# EAGLE design p2d-001 (EAGLE 9.6.2)
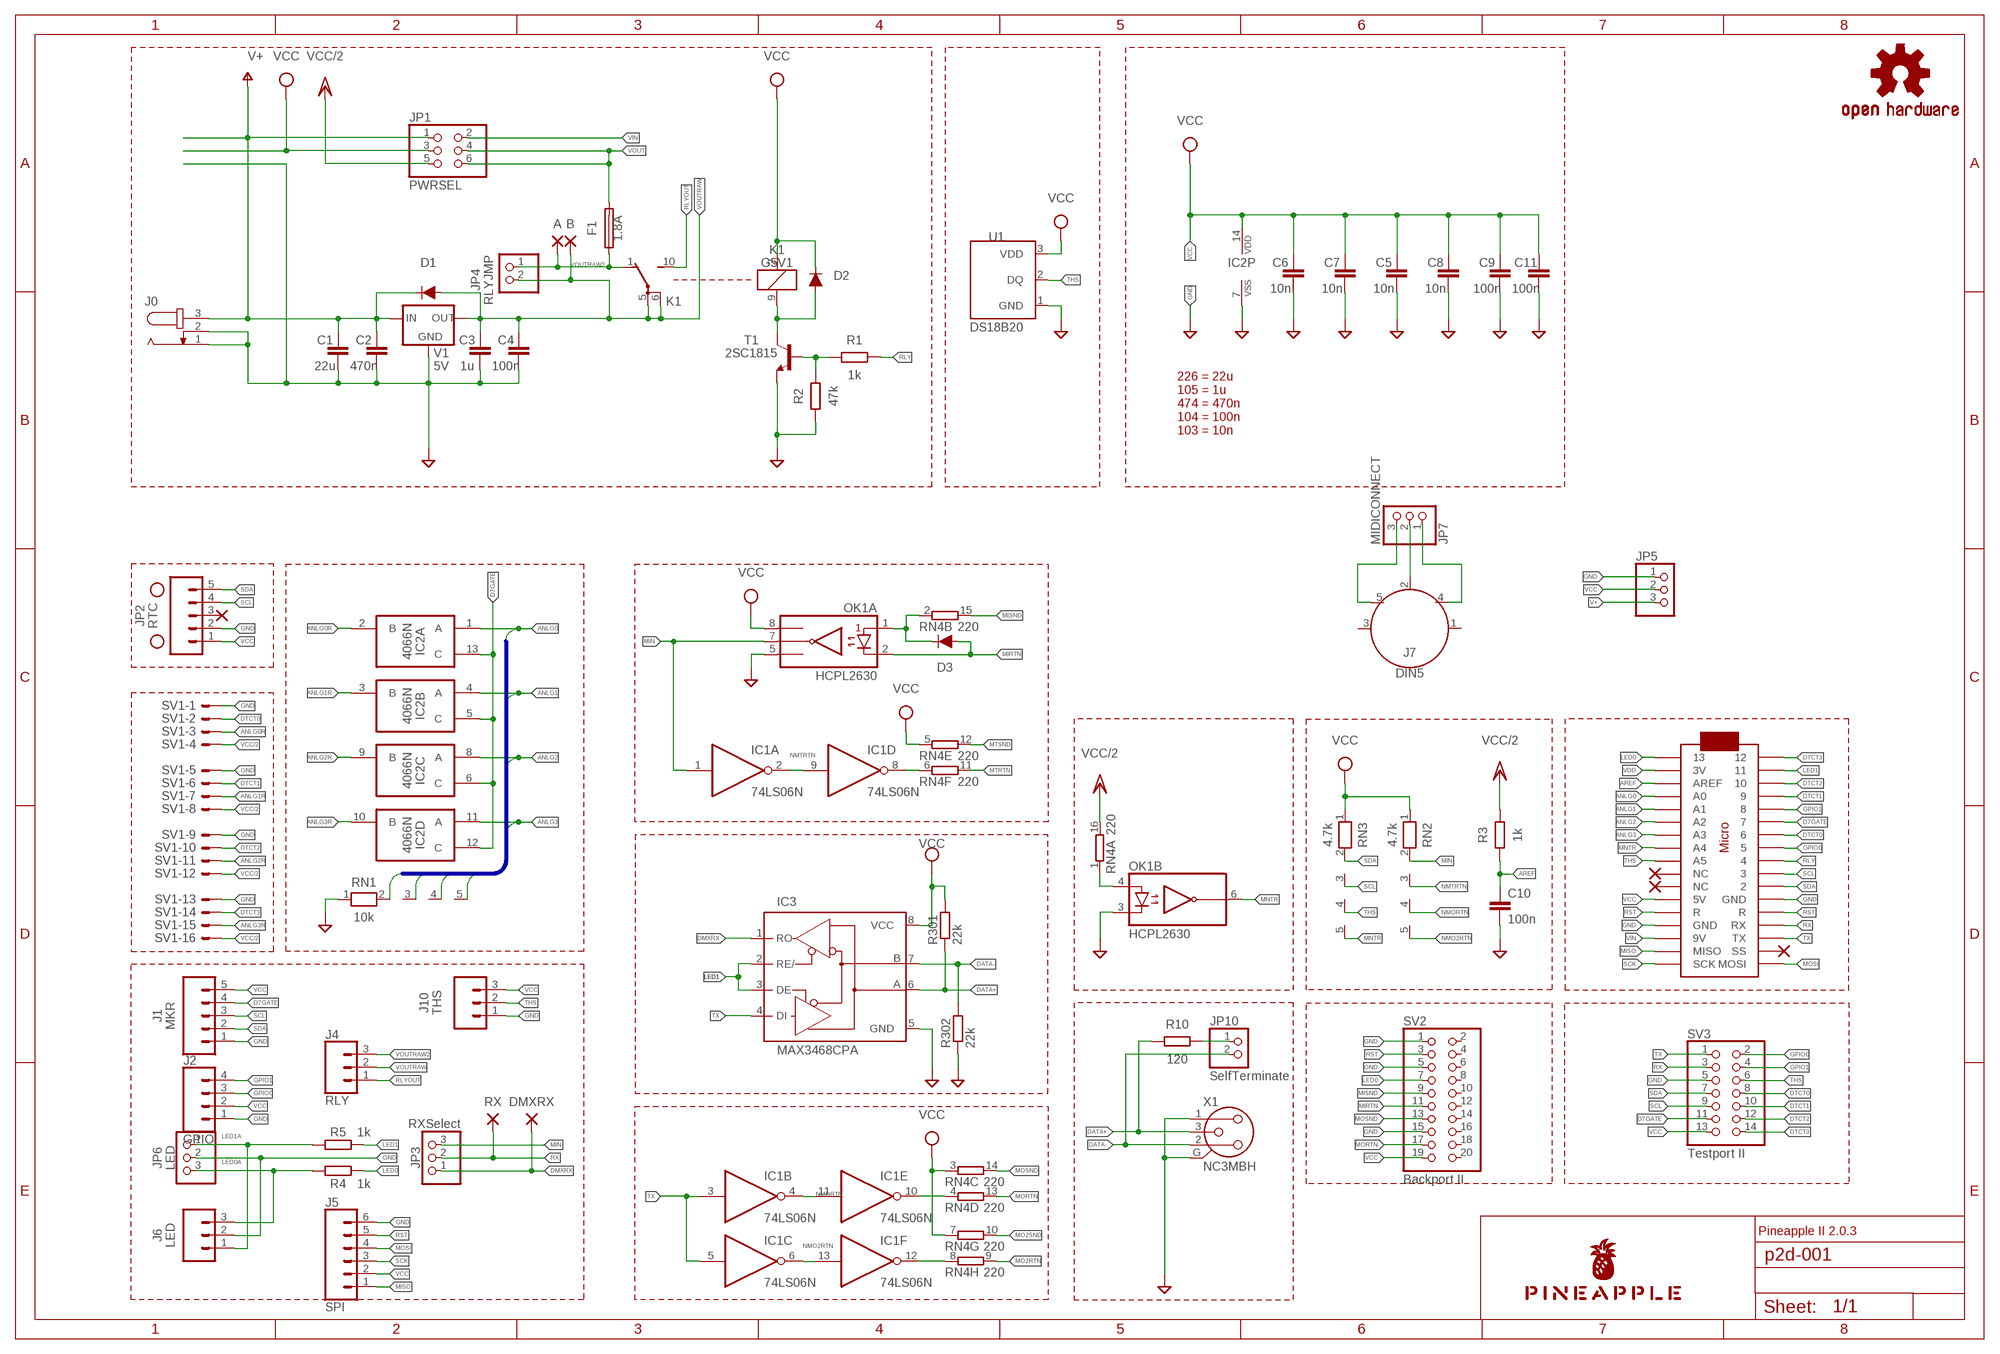
[diagram p0: schematic, sheet 1]

## Parts
A  SMD2  [SMD1,27-2,54]
B  SMD2  [SMD1,27-2,54]
C1  22u  C-EU025-050X050  [C025-050X050]
C2  470n  C-EU050-024X044  [C050-024X044]
C3  1u  C-EU050-024X044  [C050-024X044]
C4  100n  C-EU025-024X044  [C025-024X044]
C5  10n  C-EU025-024X044  [C025-024X044]
C6  10n  C-EU025-024X044  [C025-024X044]
C7  10n  C-EU025-024X044  [C025-024X044]
C8  10n  C-EU025-024X044  [C025-024X044]
C9  100n  C-EU025-024X044  [C025-024X044]
C10  100n  C-EU025-024X044  [C025-024X044]
C11  100n  C-EU025-024X044  [C025-024X044]
D1  DIODE-1N4148  [DIODE-1N4148]
D2  DIODE-1N4148  [DIODE-1N4148]
D3  DIODE-1N4148  [DIODE-1N4148]
DMXRX  SMD2  [SMD1,27-2,54]
F1  1.8A  TE5  [TE5]
H1  STAND-OFF  [STAND-OFF]
H2  STAND-OFF  [STAND-OFF]
IC1  74LS06N  [DIL14]
IC2  4066N  [DIL14]
IC3  MAX3468CPA  [DIL08]
J0  JACK-PLUG0  [SPC4077]
J1  MKR  CONN_05JST  [JST-5-PTH]
J2  GPIO  CONN_04JST-PTH  [JST-4-PTH]
J4  RLY  CONN_03JST-PTH-NS  [JST-3-PTH-NS]
J5  SPI  CONN_061.27MM  [1X06_1.27MM]
J6  LED  CONN_03JST-PTH-VERT  [JST-3-PTH-VERT]
J7  DIN5  [DIN5-RA-PTH]
J10  THS  CONN_03JST-PTH  [JST-3-PTH]
JP1  PWRSEL  PINHD-2X3  [2X03]
JP2  RTC  CONN_05  [1X05]
JP3  RXSelect  PINHD-1X3  [1X03]
JP4  RLYJMP  PINHD-1X2  [1X02]
JP5  PINHD-1X3  [1X03]
JP6  LED  PINHD-1X3  [1X03]
JP7  MIDICONNECT  PINHD-1X3  [1X03]
JP10  SelfTerminate  PINHD-1X2  [1X02]
K1  G5V1  [G5V1]
LOGO1  OSHW-LOGOS-COPPER  [OSHW-LOGO-S_COPPER]
MC1  ARDUINOMICRO  [ARDUINOMICRO]
OK1  HCPL2630  [DIL08]
R1  1k  R-EU_0204/5  [0204/5]
R2  47k  R-EU_0204/5  [0204/5]
R3  1k  R-EU_0204/5  [0204/5]
R4  1k  R-EU_0204/5  [0204/5]
R5  1k  R-EU_0204/5  [0204/5]
R10  120  R-EU_0204/5  [0204/5]
R301  22k  R-EU_M2012  [M2012]
R302  22k  R-EU_M2012  [M2012]
RN1  10k  RN04  [RN-5]
RN2  4.7k  RN04  [RN-5]
RN3  4.7k  RN04  [RN-5]
RN4  220  8R-N  [DIL16]
RX  SMD2  [SMD1,27-2,54]
SV1  ML16LE  [ML16L]
SV2  Backport II  PINHD-2X10  [2X10]
SV3  Testport II  PINHD-2X7  [2X07]
T1  2SC1815  [TO92-ECB]
U1  DS18B20  [TO-92-AMMO]
U$1  PINEAPPLE450_SILK  [PINEAPPLE450_SILK]
V1  5V  78XXL  [78XXL]
X1  NC3MBH  [NC3MBH]

## Nets
ANLG0 [analog]: IC2.1(A:A) MC1.P$31(A0) RN1.2
ANLG0R [analog]: IC2.2(A:B) SV1.3
ANLG1 [analog]: IC2.4(B:A) MC1.P$30(A1) RN1.3
ANLG1R [analog]: IC2.3(B:B) SV1.7
ANLG2 [analog]: IC2.8(C:A) MC1.P$29(A2) RN1.4
ANLG2R [analog]: IC2.9(C:B) SV1.11
ANLG3 [analog]: IC2.11(D:A) MC1.P$28(A3) RN1.5
ANLG3R [analog]: IC2.10(D:B) SV1.15
AREF: C10.1 MC1.P$32(AREF) R3.1
D7GATE: IC2.5(B:C) IC2.6(C:C) IC2.12(D:C) IC2.13(A:C) J1.4 MC1.P$6 SV3.11
DATA+: IC3.6(A) R10.1 R301.1 X1.3
DATA+R: JP10.1 R10.2
DATA-: IC3.7(B) JP10.2 R302.2 X1.2
DIN2: J7.2 JP7.2
DIN4: J7.4 JP7.1
DIN5: J7.5 JP7.3
DMXRX: DMXRX.1(P) IC3.1(RO) JP3.1
DTCT0: MC1.P$7 SV1.2 SV3.8
DTCT1: MC1.P$4 SV1.6 SV3.10
DTCT2: MC1.P$3 SV1.10 SV3.12
DTCT3: MC1.P$1 SV1.14 SV3.14
GND [gnd]: C1.2 C2.2 C3.2 C4.2 C5.2 C6.2 C7.2 C8.2 C9.2 C10.2 C11.2 IC2.7(P:VSS) IC3.5(GND) J0.1 J0.2 J1.1 J2.1 J5.6 J6.2 J10.1 JP2.2 JP5.1 JP6.2 MC1.P$12(GND) MC1.P$21(GND) OK1.3(B:C2) OK1.5(A:GND) R2.1 R302.1 RN1.1 SV1.1 SV1.5 SV1.9 SV1.13 SV2.1 SV2.5 SV2.15 SV3.5 T1.E U1.1(GND) V1.GND X1.1 X1.G
GPIO0: J2.3 MC1.P$8 SV3.2
GPIO1: J2.4 MC1.P$5 SV3.4
LED0: MC1.P$34 R4.2 SV2.7
LED0A: J6.3 JP6.3 R4.1
LED1: IC3.2(RE/) IC3.3(DE) MC1.P$2 R5.2
LED1A: J6.1 JP6.1 R5.1
MIN: IC1.1(A:I) JP3.3 OK1.7(A:VO1) RN2.2
MIRTN [gnd]: D3.A OK1.2(A:C1) SV2.11
MISND: RN4.15 SV2.9
MISNDA [gnd]: D3.C OK1.1(A:A1) RN4.2
MISO: J5.1 MC1.P$19(MISO)
MNTR: MC1.P$27(A4) OK1.6(B:VO2) RN3.5
MNTRA: OK1.4(B:A2) RN4.1
MO2RTN: RN4.9
MO2RTNR: IC1.12(F:O) RN4.8
MO2SND: RN4.10
MORTN: RN4.13 SV2.17
MORTNR: IC1.10(E:O) RN4.4
MOSI: J5.4 MC1.P$17(MOSI)
MOSND: RN4.14 SV2.13
MTRTN: RN4.11
MTRTNR: IC1.8(D:O) RN4.6
MTSND: RN4.12
NMO2RTN: IC1.6(C:O) IC1.13(F:I) RN2.5
NMORTN: IC1.4(B:O) IC1.11(E:I) RN2.4
NMTRTN: IC1.2(A:O) IC1.9(D:I) RN2.3
RLY: MC1.P$9 R1.2
RLYDRV: R1.1 R2.2 T1.B
RLYOUT: J4.1 K1.10(2:S)
RLYSNK: D2.A K1.9 T1.C
RST: J5.5 MC1.P$13(R) MC1.P$22(R) SV2.3
RX: JP3.2 MC1.P$14(RX) RX.1(P) SV3.3
SCK: J5.3 MC1.P$18(SCK)
SCL: J1.3 JP2.4 MC1.P$10 RN3.3 SV3.9
SDA: J1.2 JP2.5 MC1.P$11 RN3.2 SV3.7
THS: J10.2 MC1.P$26(A5) RN3.4 SV3.6 U1.2(DQ)
TX: IC1.3(B:I) IC1.5(C:I) IC3.4(DI) MC1.P$15(TX) SV3.1
V+ [superpower]: C1.1 C2.1 D1.C J0.3 JP1.1 JP5.3 V1.IN
VCC [power]: C5.1 C6.1 C7.1 C8.1 C9.1 C11.1 D2.C IC2.14(P:VDD) IC3.8(VCC) J1.5 J2.2 J5.2 J10.3 JP1.3 JP2.1 JP5.2 K1.2 MC1.P$23(5V) OK1.8(A:VCC) R301.2 RN2.1 RN3.1 RN4.3 RN4.5 RN4.7 SV2.19 SV3.13 U1.3(VDD)
VCC/2 [superpower]: JP1.5 R3.2 RN4.16 SV1.4 SV1.8 SV1.12 SV1.16
VDD [power]: MC1.P$33(3V)
VIN [superpower]: JP1.2 MC1.P$20(9V)
VOUT [superpower]: F1.2 JP1.4 JP1.6
VOUTRAW [superpower]: B.1(P) C3.1 C4.1 D1.A J4.2 JP4.2 K1.5(2:P) K1.6(2:P) V1.OUT
VOUTRAW2 [superpower]: A.1(P) F1.1 J4.3 JP4.1 K1.1(2:O)
Unconnected: J7.1 J7.3 JP2.3 MC1.P$16(SS) MC1.P$24(NC) MC1.P$25(NC) SV2.2 SV2.4 SV2.6 SV2.8 SV2.10 SV2.12 SV2.14 SV2.16 SV2.18 SV2.20

## Buses
ANLG[0..3]

## Notes on the sheet
- 226 = 22u
  105 = 1u
  474 = 470n
  104 = 100n
  103 = 10n
- Pineapple II 2.0.3

## Power pins joined to a net without a drawn wire
GND: IC1.7(P:GND)
VCC: IC1.14(P:VCC)

## Library data of the parts
A B DMXRX RX = wirepad:SMD2: SMD PAD
C1-C4 C10 = rcl:C-EU: CAPACITOR, European symbol; SPICEPREFIX: C
C5-C9 C11 = resistor:C-EU: CAPACITOR, European symbol
D1-D3 = SparkFun-DiscreteSemi:DIODE: Diode These are standard reverse protection diodes and small signal diodes. SparkFun Products: SparkFun SparkPunk Sound Kit <https://www.sparkfun.com/products/11177> SparkFun ESP8266 Thing <https://www.sparkfun.com/products/13231>; PROD_ID: DIO-08378; VALUE: 200mA/100V/1V
F1 = fuse:TE5: FUSE Wickmann; OC_FARNELL: unknown; OC_NEWARK: unknown
H1 H2 = SparkFun-Hardware:STAND-OFF: Stand Off Drill holes for mechanically mounting via screws, standoffs, etc. Note: Use the keepout ring to avoid running the screw head into surrounding components. Variant Overviews STAND-OFF - Mechanical footprint for a #4 phillips button head screw. STAND-OFF-TIGHT - Mechanical footprint for a #4 phillips button head screw, Example SparkFun Products Screw - Phillips Head (1/4", 4-40, 10 pack) <https://www.sparkfun.com/products/10453> (PRT-10453) Screw - Phillips Head (1/2", 4-40, 10 pack) <https://www.sparkfun.com/products/10452> (PRT-10452) Screw - Phillips Head (3/4", 4-40, 10 pack) <https://www.sparkfun.com/products/10451> (PRT-10451) Screw - Phillips Head (1", 4-40, 10 pack) <https://www.sparkfun.com/products/10450> (PRT-10450)
IC1 = 74xx-us:74*06: Hex INVERTER, open collector high-voltage output
IC2 = 40xx:4066: Quad bilateral ANALOG SWITCH
IC3 = maxim:MAX34*: +5V, Fail-Safe, 40Mbps, Profibus RS-485/RS-422 Transceivers Source: MAX3465-MAX3469.pdf; OC_FARNELL: unknown; OC_NEWARK: unknown
J0 = con-jack:JACK-PLUG: DC POWER JACK Power Jack, DC, Right Angle, Through Hole, Rated 5A at 16VDC, PC Terminals Distributor: Farnell (www.Farnell.de) Drawing: 84N1161.pdf / 84N1162.pdf Manufacturer: SPC Technology (www.spctechnology.com) Type: SPC4077 / SPC 4078; OC_FARNELL: unknown; OC_NEWARK: unknown
J1 = SparkFun-Connectors:CONN_05: Multi connection point. Often used as Generic Header-pin footprint for 0.1 inch spaced/style header connections On any of the 0.1 inch spaced packages, you can populate with these: Break Away Headers - Straight <https://www.sparkfun.com/products/116> (PRT-00116) Break Away Male Headers - Right Angle <https://www.sparkfun.com/products/553> (PRT-00553) Female Headers <https://www.sparkfun.com/products/115> (PRT-00115) Break Away Headers - Machine Pin <https://www.sparkfun.com/products/117> (PRT-00117) Break Away Female Headers - Swiss Machine Pin <https://www.sparkfun.com/products/743> (PRT-00743) For SCREWTERMINALS and SPRING TERMINALS visit here: Screw Terimnals on SparkFun.com <https://www.sparkfun.com/search/results?term=Screw+Terminals> (5mm/3.5mm/2.54mm spacing) This device is also useful as a general connection point to wire up your design to another part of your project. Our various solder wires solder well into these plated through hole pads. Hook-Up Wire - Assortment (Stranded, 22 AWG) <https://www.sparkfun.com/products/11375> (PRT-11375) Hook-Up Wire - Assortment (Solid Core, 22 AWG) <https://www.sparkfun.com/products/11367> (PRT-11367) View the entire wire category on our website here <https://www.sparkfun.com/categories/141> Special notes: Molex polarized connector foot print use with SKU : PRT-08231 with associated crimp pins and housings. 1MM SMD Version SKU: PRT-10208; SF_ID: PRT-09917
J2 = SparkFun-Connectors:CONN_04: Multi connection point. Often used as Generic Header-pin footprint for 0.1 inch spaced/style header connections On any of the 0.1 inch spaced packages, you can populate with these: Break Away Headers - Straight <https://www.sparkfun.com/products/116> (PRT-00116) Break Away Male Headers - Right Angle <https://www.sparkfun.com/products/553> (PRT-00553) Female Headers <https://www.sparkfun.com/products/115> (PRT-00115) Break Away Headers - Machine Pin <https://www.sparkfun.com/products/117> (PRT-00117) Break Away Female Headers - Swiss Machine Pin <https://www.sparkfun.com/products/743> (PRT-00743) For SCREWTERMINALS and SPRING TERMINALS visit here: Screw Terimnals on SparkFun.com <https://www.sparkfun.com/search/results?term=Screw+Terminals> (5mm/3.5mm/2.54mm spacing) This device is also useful as a general connection point to wire up your design to another part of your project. Our various solder wires solder well into these plated through hole pads. Hook-Up Wire - Assortment (Stranded, 22 AWG) <https://www.sparkfun.com/products/11375> (PRT-11375) Hook-Up Wire - Assortment (Solid Core, 22 AWG) <https://www.sparkfun.com/products/11367> (PRT-11367) View the entire wire category on our website here <https://www.sparkfun.com/categories/141> Special notes: Molex polarized connector foot print use with SKU : PRT-08231 with associated crimp pins and housings. 1MM SMD Version SKU: PRT-10208; PROD_ID: WIRE-13531; SF_ID: PRT-09916
J4 = SparkFun-Connectors:CONN_03: Multi connection point. Often used as Generic Header-pin footprint for 0.1 inch spaced/style header connections On any of the 0.1 inch spaced packages, you can populate with these: Break Away Headers - Straight <https://www.sparkfun.com/products/116> (PRT-00116) Break Away Male Headers - Right Angle <https://www.sparkfun.com/products/553> (PRT-00553) Female Headers <https://www.sparkfun.com/products/115> (PRT-00115) Break Away Headers - Machine Pin <https://www.sparkfun.com/products/117> (PRT-00117) Break Away Female Headers - Swiss Machine Pin <https://www.sparkfun.com/products/743> (PRT-00743) Stackable Header - 3 Pin (Female, 0.1") <https://www.sparkfun.com/products/13875> (PRT-13875) For SCREWTERMINALS and SPRING TERMINALS visit here: Screw Terimnals on SparkFun.com <https://www.sparkfun.com/search/results?term=Screw+Terminals> (5mm/3.5mm/2.54mm spacing) This device is also useful as a general connection point to wire up your design to another part of your project. Our various solder wires solder well into these plated through hole pads. Hook-Up Wire - Assortment (Stranded, 22 AWG) <https://www.sparkfun.com/products/11375> (PRT-11375) Hook-Up Wire - Assortment (Solid Core, 22 AWG) <https://www.sparkfun.com/products/11367> (PRT-11367) View the entire wire category on our website here <https://www.sparkfun.com/categories/141> Special notes: Molex polarized connector foot print use with SKU : PRT-08232 with associated crimp pins and housings.
J5 = SparkFun-Connectors:CONN_06: Multi connection point. Often used as Generic Header-pin footprint for 0.1 inch spaced/style header connections On any of the 0.1 inch spaced packages, you can populate with these: Break Away Headers - Straight <https://www.sparkfun.com/products/116> (PRT-00116) Break Away Male Headers - Right Angle <https://www.sparkfun.com/products/553> (PRT-00553) Female Headers <https://www.sparkfun.com/products/115> (PRT-00115) Break Away Headers - Machine Pin <https://www.sparkfun.com/products/117> (PRT-00117) Break Away Female Headers - Swiss Machine Pin <https://www.sparkfun.com/products/743> (PRT-00743) Arduino Stackable Header - 6 Pin <https://www.sparkfun.com/products/9280> (PRT-09280) For SCREWTERMINALS and SPRING TERMINALS visit here: Screw Terimnals on SparkFun.com <https://www.sparkfun.com/search/results?term=Screw+Terminals> (5mm/3.5mm/2.54mm spacing) This device is also useful as a general connection point to wire up your design to another part of your project. Our various solder wires solder well into these plated through hole pads. Hook-Up Wire - Assortment (Stranded, 22 AWG) <https://www.sparkfun.com/products/11375> (PRT-11375) Hook-Up Wire - Assortment (Solid Core, 22 AWG) <https://www.sparkfun.com/products/11367> (PRT-11367) View the entire wire category on our website here <https://www.sparkfun.com/categories/141>
J6 = SparkFun-Connectors:CONN_03: Multi connection point. Often used as Generic Header-pin footprint for 0.1 inch spaced/style header connections On any of the 0.1 inch spaced packages, you can populate with these: Break Away Headers - Straight <https://www.sparkfun.com/products/116> (PRT-00116) Break Away Male Headers - Right Angle <https://www.sparkfun.com/products/553> (PRT-00553) Female Headers <https://www.sparkfun.com/products/115> (PRT-00115) Break Away Headers - Machine Pin <https://www.sparkfun.com/products/117> (PRT-00117) Break Away Female Headers - Swiss Machine Pin <https://www.sparkfun.com/products/743> (PRT-00743) Stackable Header - 3 Pin (Female, 0.1") <https://www.sparkfun.com/products/13875> (PRT-13875) For SCREWTERMINALS and SPRING TERMINALS visit here: Screw Terimnals on SparkFun.com <https://www.sparkfun.com/search/results?term=Screw+Terminals> (5mm/3.5mm/2.54mm spacing) This device is also useful as a general connection point to wire up your design to another part of your project. Our various solder wires solder well into these plated through hole pads. Hook-Up Wire - Assortment (Stranded, 22 AWG) <https://www.sparkfun.com/products/11375> (PRT-11375) Hook-Up Wire - Assortment (Solid Core, 22 AWG) <https://www.sparkfun.com/products/11367> (PRT-11367) View the entire wire category on our website here <https://www.sparkfun.com/categories/141> Special notes: Molex polarized connector foot print use with SKU : PRT-08232 with associated crimp pins and housings.; PROD_ID: CONN-13230
J7 = SparkFun-Connectors:DIN5: DIN5 Connector - Female Right Angle (frequently used as a MIDI Jack connector) This type of connector and cable is frequently used for transmitting midi data (musical instrument digital interface). It is what you usually see on a keyboard or set of electronic drums. Learn more here <https://en.wikipedia.org/wiki/MIDI>. For more information on the pinout and electrical specifications of MIDI communications, please see the following resource: https://www.midi.org/specifications/item/midi-din-electrical-specification Here is the connector we sell at SparkFun: MIDI Connector - Female Right Angle <https://www.sparkfun.com/products/9536> (PRT-09536) Datasheet <hhttp://www.sparkfun.com/datasheets/Prototyping/Connectors/MIDI-RA.pdf> It is used on this SparkFun product: SparkFun MIDI Shield <https://www.sparkfun.com/products/12898> (DEV-12898); PROD_ID: CONN-09481
J10 = SparkFun-Connectors:CONN_03: Multi connection point. Often used as Generic Header-pin footprint for 0.1 inch spaced/style header connections On any of the 0.1 inch spaced packages, you can populate with these: Break Away Headers - Straight <https://www.sparkfun.com/products/116> (PRT-00116) Break Away Male Headers - Right Angle <https://www.sparkfun.com/products/553> (PRT-00553) Female Headers <https://www.sparkfun.com/products/115> (PRT-00115) Break Away Headers - Machine Pin <https://www.sparkfun.com/products/117> (PRT-00117) Break Away Female Headers - Swiss Machine Pin <https://www.sparkfun.com/products/743> (PRT-00743) Stackable Header - 3 Pin (Female, 0.1") <https://www.sparkfun.com/products/13875> (PRT-13875) For SCREWTERMINALS and SPRING TERMINALS visit here: Screw Terimnals on SparkFun.com <https://www.sparkfun.com/search/results?term=Screw+Terminals> (5mm/3.5mm/2.54mm spacing) This device is also useful as a general connection point to wire up your design to another part of your project. Our various solder wires solder well into these plated through hole pads. Hook-Up Wire - Assortment (Stranded, 22 AWG) <https://www.sparkfun.com/products/11375> (PRT-11375) Hook-Up Wire - Assortment (Solid Core, 22 AWG) <https://www.sparkfun.com/products/11367> (PRT-11367) View the entire wire category on our website here <https://www.sparkfun.com/categories/141> Special notes: Molex polarized connector foot print use with SKU : PRT-08232 with associated crimp pins and housings.; PROD_ID: WIRE-10037; SF_ID: PRT-09915
JP1 = pinhead:PINHD-2X3: PIN HEADER
JP2 = SparkFun-Connectors:CONN_05: Multi connection point. Often used as Generic Header-pin footprint for 0.1 inch spaced/style header connections On any of the 0.1 inch spaced packages, you can populate with these: Break Away Headers - Straight <https://www.sparkfun.com/products/116> (PRT-00116) Break Away Male Headers - Right Angle <https://www.sparkfun.com/products/553> (PRT-00553) Female Headers <https://www.sparkfun.com/products/115> (PRT-00115) Break Away Headers - Machine Pin <https://www.sparkfun.com/products/117> (PRT-00117) Break Away Female Headers - Swiss Machine Pin <https://www.sparkfun.com/products/743> (PRT-00743) For SCREWTERMINALS and SPRING TERMINALS visit here: Screw Terimnals on SparkFun.com <https://www.sparkfun.com/search/results?term=Screw+Terminals> (5mm/3.5mm/2.54mm spacing) This device is also useful as a general connection point to wire up your design to another part of your project. Our various solder wires solder well into these plated through hole pads. Hook-Up Wire - Assortment (Stranded, 22 AWG) <https://www.sparkfun.com/products/11375> (PRT-11375) Hook-Up Wire - Assortment (Solid Core, 22 AWG) <https://www.sparkfun.com/products/11367> (PRT-11367) View the entire wire category on our website here <https://www.sparkfun.com/categories/141> Special notes: Molex polarized connector foot print use with SKU : PRT-08231 with associated crimp pins and housings. 1MM SMD Version SKU: PRT-10208
JP3 JP5-JP7 = pinhead:PINHD-1X3: PIN HEADER
JP4 JP10 = pinhead:PINHD-1X2: PIN HEADER
K1 = relay:G5V1: RELAY 1 x switch, 0.5 A/125 V AC, 1 A/24 V DC , Omron; MPN: G5V-1-DC24; OC_FARNELL: 9949593; OC_NEWARK: 36M6377
LOGO1 = SparkFun-Aesthetics:OSHW-LOGO: Open-Source Hardware (OSHW) Logo This logo indicates the piece of hardware it is found on incorporates a OSHW license and/or adheres to the definition of open source hardware found here: http://freedomdefined.org/OSHW
MC1 = adafruit:ARDUINOMICRO
OK1 = optocoupler:HCPL2630: HEWLETT PACKARD OPTO COUPLER; MF: AGILENT TECHNOLOGIES; MPN: HCPL-2630-000E; OC_FARNELL: 9994904; OC_NEWARK: 88H7813
R1-R5 R10 = resistor:R-EU_: RESISTOR, European symbol
R301 R302 = rcl:R-EU_: RESISTOR, European symbol; SPICEPREFIX: R
RN1-RN3 = resistor-net:RN04: RESISTOR NETWORK; OC_FARNELL: unknown; OC_NEWARK: unknown
RN4 = resistor-dil:8R-N: DIL RESISTOR; OC_FARNELL: unknown; OC_NEWARK: unknown
SV1 = con-ml:ML16LE: HARTING; OC_FARNELL: unknown; OC_NEWARK: unknown
SV2 = pinhead:PINHD-2X10: PIN HEADER
SV3 = pinhead:PINHD-2X7: PIN HEADER
T1 = transistor:2SC1815: NPN EPITAXIAL TRANSISTOR Source: TOSHIBA .. 2SC1815 1.pdf
U1 = SparkFun-Sensors:DS18B20: Dallas/Maxim DS18B20 1-Wire Temperature Sensor The DS18B20 reports degrees C with 9 to 12-bit precision, -55C to 125C (+/-0.5C). Each sensor has a unique 64-Bit Serial number etched into it - allows for a huge number of sensors to be used on one data bus. Datasheet <http://datasheets.maximintegrated.com/en/ds/DS18B20.pdf> SparkFun Products One Wire Digital Temperature Sensor - DS18B20 <https://www.sparkfun.com/products/245> (SEN-00245); STORE_ID: SEN-00245
U$1 = pineapple:PINEAPPLE450_SILK
V1 = v-reg:78XXL: VOLTAGE REGULATOR
X1 = con-neutrik_ag:NC3: Neutrik Audio Connector XLR SERIES Stereo 1/4" jack Source: www.neutrik.com/; MF: NEUTRIK; MPN: NC3MBH; OC_FARNELL: unknown; OC_NEWARK: 91F3470

## Net classes
0 default: width 0.152 mm, drill 0.152 mm, clearance 0.152 mm
1 gnd: width 0.305 mm, drill 0.152 mm, clearance 0.152 mm
2 power: width 0.508 mm, drill 0.152 mm, clearance 0.152 mm
3 analog: width 0.305 mm, drill 0.152 mm, clearance 0.152 mm
4 superpower: width 1.016 mm, drill 0.152 mm, clearance 0.152 mm

## Board
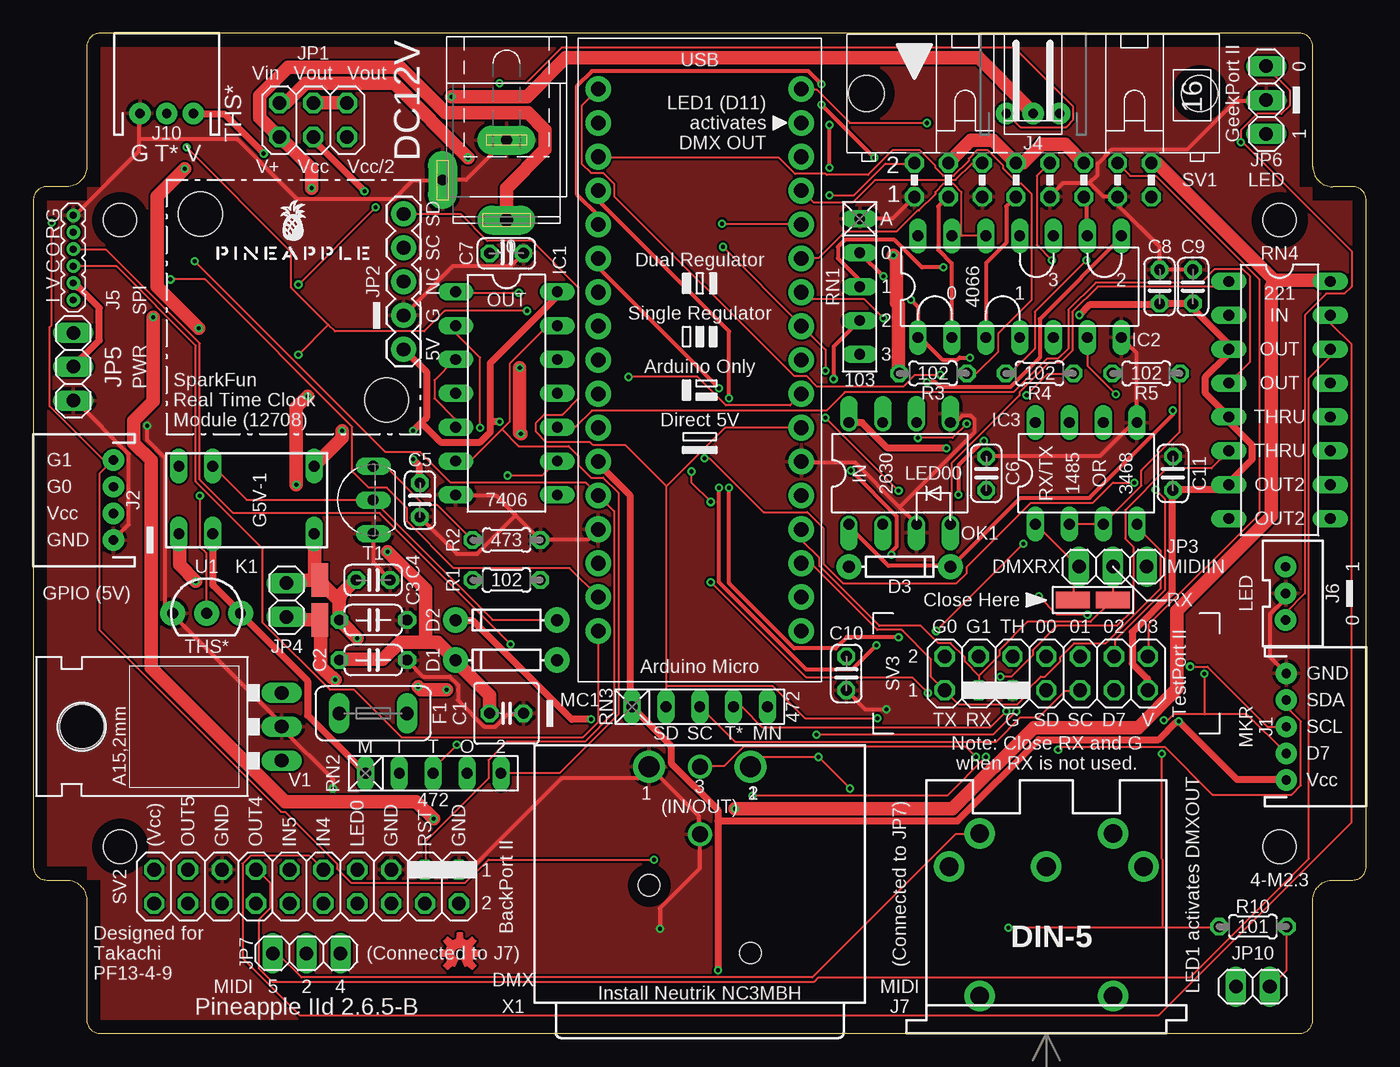
[diagram p1: board, top side]
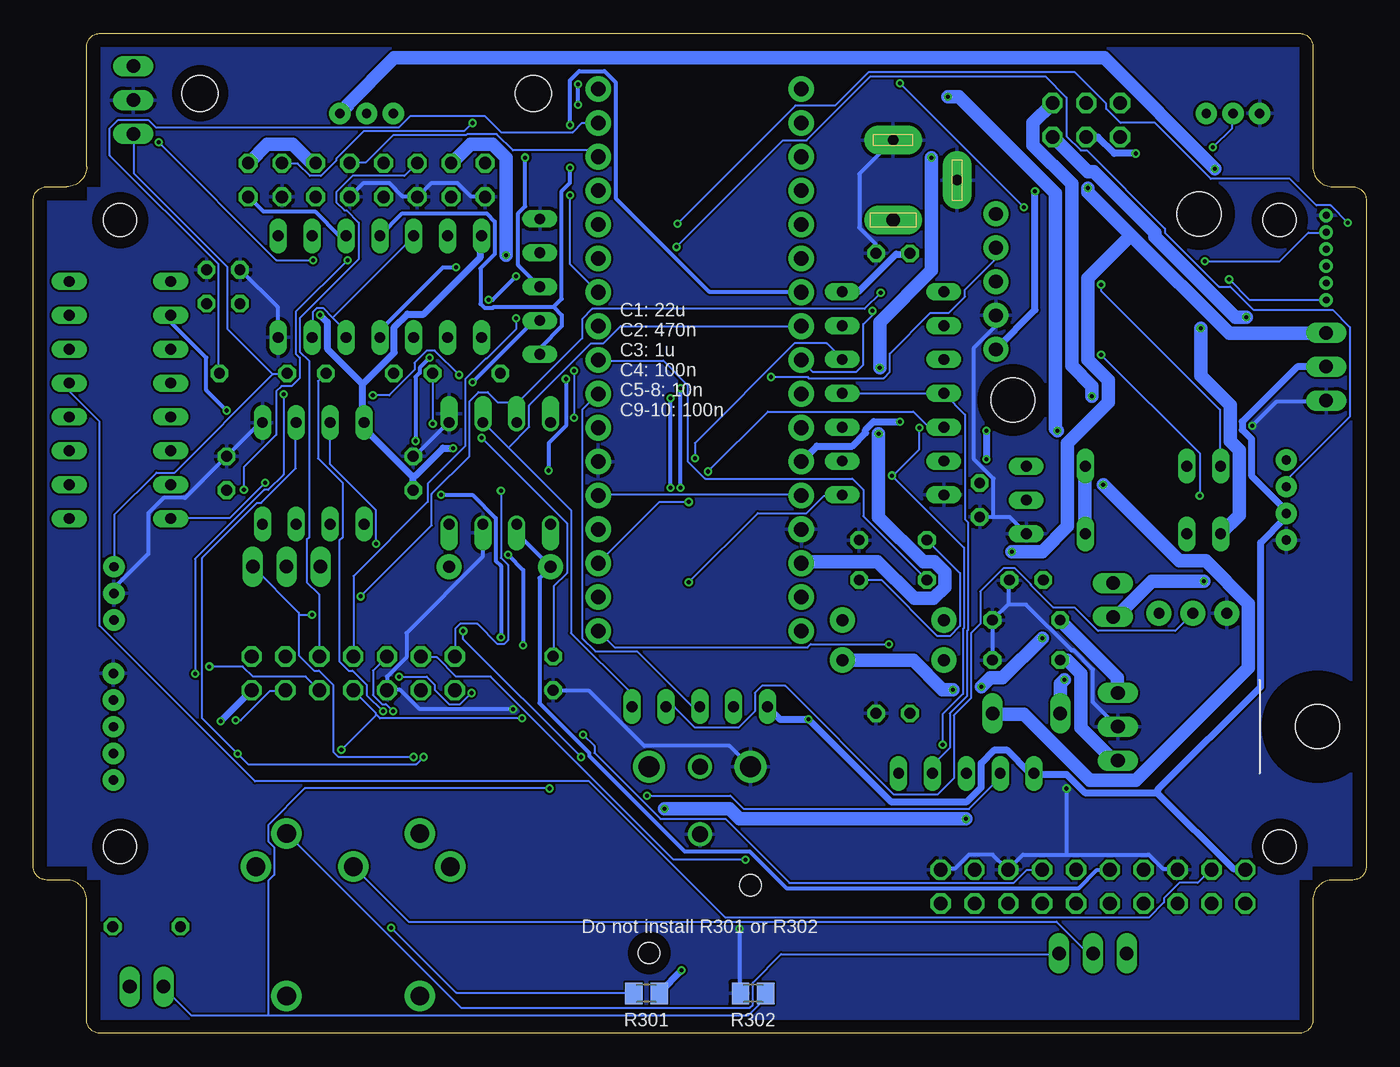
[diagram p2: board, bottom side, seen from below]

Size 100 x 75 mm. Coordinates in mm from the lower left corner, seen from the top.
Outline: 95,75 5,75 arc90 4,74 4,65 arc-90 2.5,63.5 1,63.5 arc90 0,62.5 0,12.5 arc90 1,11.5 2.5,11.5 arc-90 4,10 4,1 arc90 5,0 95,0 arc90 96,1 96,10 arc-90 97.5,11.5 99,11.5 arc90 100,12.5 100,62.5 arc90 99,63.5 97.5,63.5 arc-90 96,65 96,74 arc90 95,75
Copper layers (1*16): Top 0.035mm / dielectric 1.5mm / Bottom 0.035mm
Design rules "SeeedStudio_2layer_DRU_no_angle_20140221": minimum track width 6mil, minimum drill 12mil, track to track 6mil, track to pad 6mil, pad to pad 6mil, via to via 6mil, smd to smd 0mil, copper to edge 10mil, drill to drill 10mil, minimum pad ring 10mil, minimum via ring 6mil, stop-mask expansion 2mil, vias tented up to drill 100mil, thermal gap 10mil
Holes 2.5 mm at 93.5,61 6.5,61 6.5,14 93.5,14
Holes 2.7 mm at 87.5,70.5 62.5,70.5
tRestrict: area 4.5,59 to 8.5,63; area 91.5,59 to 95.5,63; area 4.5,12 to 8.5,16; area 91.5,12 to 95.5,16; area 4,74 to 96,75; area 99,11.5 to 100,63.5; area 4,0 to 96,1; area 0,11.5 to 1,63.5; area 0,62.5 to 4,63.5; area 4,63.5 to 5,75; area 95,63.5 to 96,75; area 96,62.5 to 100,63.5; 10 more areas
bRestrict: area 4.5,12 to 8.5,16; area 91.5,12 to 95.5,16; area 91.5,59 to 95.5,63; area 4.5,59 to 8.5,63; area 95,0 to 96,11.5; area 96,11.5 to 100,12.5; area 99,11.5 to 100,63.5; area 96,62.5 to 100,63.5; area 95,63.5 to 96,75; area 4,74 to 96,75; area 4,63.5 to 5,75; area 0,62.5 to 4,63.5; 10 more areas

### Footprints (pad centres in the part's own frame; a part is rotated, then mirrored left to right if it is on the bottom)
SMD1,27-2,54 = smd 1.27 x 2.54: 1 0,0
C025-050X050 = drill 0.813 octagon: 1 -1.27,0; 2 1.27,0
C050-024X044 = drill 0.813 octagon: 1 -2.54,0; 2 2.54,0
C025-024X044 = drill 0.813 octagon: 1 -1.27,0; 2 1.27,0
DIODE-1N4148 = drill 0.9 pad 1.88: A -3.81,0; C 3.81,0
TE5 = drill 1.016 long: 1 -2.54,0; 2 2.54,0
STAND-OFF = hole 3.302: 0,0
DIL14 = drill 0.813 long: 1 -7.62,-3.81; 2 -5.08,-3.81; 3 -2.54,-3.81; 4 0,-3.81; 5 2.54,-3.81; 6 5.08,-3.81; 7 7.62,-3.81; 8 7.62,3.81; 9 5.08,3.81; 10 2.54,3.81; 11 0,3.81; 12 -2.54,3.81; 13 -5.08,3.81; 14 -7.62,3.81
DIL08 = drill 0.813 long: 1 -3.81,-3.81; 2 -1.27,-3.81; 3 1.27,-3.81; 4 3.81,-3.81; 5 3.81,3.81; 6 1.27,3.81; 7 -1.27,3.81; 8 -3.81,3.81
SPC4077 = drill 0.8 pad 2.184 long: 1 -3,0; 2 0,-4.8 | drill 1 pad 2.184 long: 3 3,0
JST-5-PTH = drill 0.7 pad 1.6: 1 -4,0; 2 -2,0; 3 0,0; 4 2,0; 5 4,0
JST-4-PTH = drill 0.7 pad 1.6: 1 -3,0; 2 -1,0; 3 1,0; 4 3,0
JST-3-PTH-NS = drill 0.7 pad 1.6: 1 -2,0; 2 0,0; 3 2,0
1X06_1.27MM = drill 0.508 pad 1: 1 0,0; 2 1.27,0; 3 2.54,0; 4 3.81,0; 5 5.08,0; 6 6.35,0
JST-3-PTH-VERT = drill 0.7 pad 1.6: 1 -2,-0.55; 2 0,-0.55; 3 2,-0.55
DIN5-RA-PTH = drill 1.4 pad 2.286: 1 7.3,12.5; 2 0,12.5; 3 -7.3,12.5; 4 5,15; 5 -5,15; 6 -5,2.8; 7 5,2.8
JST-3-PTH = drill 0.7 pad 1.6: 1 -2,0; 2 0,0; 3 2,0
2X03 = drill 1.016 octagon: 1 -2.54,-1.27; 2 -2.54,1.27; 3 0,-1.27; 4 0,1.27; 5 2.54,-1.27; 6 2.54,1.27
1X05 = drill 1.016 pad 1.88: 1 0,0; 2 2.54,0; 3 5.08,0; 4 7.62,0; 5 10.16,0
1X03 = drill 1.016 long: 1 -2.54,0; 2 0,0; 3 2.54,0
1X02 = drill 1.016 long: 1 -1.27,0; 2 1.27,0
G5V1 = drill 0.813 long: 1 -5.08,-2.54; 2 -2.54,-2.54; 5 5.08,-2.54; 6 5.08,2.54; 9 -2.54,2.54; 10 -5.08,2.54
ARDUINOMICRO = drill 1.1 pad 1.93: P$1 -20.32,7.62; P$2 -17.78,7.62; P$3 -15.24,7.62; P$4 -12.7,7.62; P$5 -10.16,7.62; P$6 -7.62,7.62; P$7 -5.08,7.62; P$8 -2.54,7.62; P$9 0,7.62; P$10 2.54,7.62; P$11 5.08,7.62; P$12 12.7,-7.62; P$13 10.16,-7.62; P$14 12.7,7.62; P$15 15.24,7.62; P$16 17.78,7.62; P$17 20.32,7.62; P$18 20.32,-7.62; P$19 17.78,-7.62; P$20 15.24,-7.62; P$21 7.62,7.62; P$22 10.16,7.62; P$23 7.62,-7.62; P$24 5.08,-7.62; P$25 2.54,-7.62; P$26 0,-7.62; P$27 -2.54,-7.62; P$28 -5.08,-7.62; P$29 -7.62,-7.62; P$30 -10.16,-7.62; P$31 -12.7,-7.62; P$32 -15.24,-7.62; P$33 -17.78,-7.62; P$34 -20.32,-7.62
DIL08' = drill 0.813 offset: 1 -3.81,-3.81; 2 -1.27,-3.81; 3 1.27,-3.81; 4 3.81,-3.81; 5 3.81,3.81; 6 1.27,3.81; 7 -1.27,3.81; 8 -3.81,3.81
0204/5 = drill 0.813 octagon: 1 -2.54,0; 2 2.54,0
M2012 = smd 1.3 x 1.6: 1 -0.95,0; 2 0.95,0
RN-5 = drill 0.813 long: 1 -5.08,0; 2 -2.54,0; 3 0,0; 4 2.54,0; 5 5.08,0
DIL16 = drill 0.813 long: 1 -8.89,-3.81; 2 -6.35,-3.81; 3 -3.81,-3.81; 4 -1.27,-3.81; 5 1.27,-3.81; 6 3.81,-3.81; 7 6.35,-3.81; 8 8.89,-3.81; 9 8.89,3.81; 10 6.35,3.81; 11 3.81,3.81; 12 1.27,3.81; 13 -1.27,3.81; 14 -3.81,3.81; 15 -6.35,3.81; 16 -8.89,3.81
ML16L = drill 0.914 octagon: 1 -8.89,-1.27; 2 -8.89,1.27; 3 -6.35,-1.27; 4 -6.35,1.27; 5 -3.81,-1.27; 6 -3.81,1.27; 7 -1.27,-1.27; 8 -1.27,1.27; 9 1.27,-1.27; 10 1.27,1.27; 11 3.81,-1.27; 12 3.81,1.27; 13 6.35,-1.27; 14 6.35,1.27; 15 8.89,-1.27; 16 8.89,1.27
2X10 = drill 1.016 octagon: 1 -11.43,-1.27; 2 -11.43,1.27; 3 -8.89,-1.27; 4 -8.89,1.27; 5 -6.35,-1.27; 6 -6.35,1.27; 7 -3.81,-1.27; 8 -3.81,1.27; 9 -1.27,-1.27; 10 -1.27,1.27; 11 1.27,-1.27; 12 1.27,1.27; 13 3.81,-1.27; 14 3.81,1.27; 15 6.35,-1.27; 16 6.35,1.27; 17 8.89,-1.27; 18 8.89,1.27; 19 11.43,-1.27; 20 11.43,1.27
2X07 = drill 1.016 octagon: 1 -7.62,-1.27; 2 -7.62,1.27; 3 -5.08,-1.27; 4 -5.08,1.27; 5 -2.54,-1.27; 6 -2.54,1.27; 7 0,-1.27; 8 0,1.27; 9 2.54,-1.27; 10 2.54,1.27; 11 5.08,-1.27; 12 5.08,1.27; 13 7.62,-1.27; 14 7.62,1.27
TO92-ECB = drill 0.813 long: B 2.54,0; C 0,0; E -2.54,0
TO-92-AMMO = drill 0.813 pad 1.88: 1 -2.54,0; 2 0,0; 3 2.54,0
78XXL = drill 1.016 long: GND 0,-3.81; IN -2.54,-3.81; OUT 2.54,-3.81 | hole 3.302: 0,11.176
NC3MBH = drill 1.6: 1 3.81,0; 2 -3.81,0 | drill 1.2: 3 0,0; G 0,5.08 | hole 1.6: -3.81,13.97; 3.81,8.89

### Placement (x,y rotation side)
A  21.5,31 0 top
B  21.5,34 0 top
C1  35.5,24 0 top
C2  25.5,28 0 top
C3  25.5,31 0 top
C4  25.5,34 0 top
C5  29,40 270 top
C6  71.5,42 90 top
C7  35.5,58.5 0 top
C8  84.5,56 90 top
C9  87,56 90 top
C10  61,27 270 top
C11  85.5,42 90 top
D1  35.5,28 180 top
D2  35.5,31 180 top
D3  65,35 0 top
DMXRX  78,32.5 90 top
F1  25.5,24 0 top
H1  26.51,47.49 0 top
H2  12.54,61.46 0 top
IC1  35.5,48 270 top
IC2  74,56 0 top
IC3  79,42 0 top
J0  35.5,64 270 top
J1  94,23 270 top
J2  6,40 90 top
J4  75,69 0 top
J5  3,55 90 top
J6  94.5,33 270 top
J7  76,0 0 top
J10  10,69 0 top
JP1  21,68.5 0 top
JP2  27.78,51.3 90 top
JP3  81,35 0 top
JP4  19,32.5 90 top
JP5  3,50 90 top
JP6  92.5,70 90 top
JP7  20.5,6 180 top
JP10  91.5,3.5 180 top
K1  16,40 0 top
LOGO1  32,6 0 top
MC1  50,50.5 270 top
OK1  HCPL2630  [DIL08']  65,42 0 top
R1  35.5,34 180 top
R2  35.5,37 180 top
R3  67.5,49.5 180 top
R4  75.5,49.5 0 top
R5  83.5,49.5 0 top
R10  91.5,8 0 top
R301  54,3 0 bottom
R302  46,3 0 bottom
RN1  62,56 270 top
RN2  30,19.5 0 top
RN3  50,24.5 0 top
RN4  93.5,47.5 270 top
RX  81,32.5 90 top
SV1  75,64 0 top
SV2  20.5,11 180 top
SV3  76,27 0 top
T1  25.5,40 90 top
U1  13,31.5 0 top
U$1  19.5,58 0 top
V1  14.82,23 90 top
X1  50,20 180 top

### Tracks (layer width: path | path; a pad name or v marks a point on that pad's centre or on a via)
ANLG0  (via drill 0.3)
  Top 0.305: v65.84,55.02 66.37,54.48 IC2.1 66.52,52.2 68.2,50.52 69.34,50.52 69.49,50.67 v70.26,50.67 | v63.78,56.77 62.03,58.52 RN1.2 | v52.2,47.62 52.2,52.65 42.44,62.41 42.44,63.17 MC1.P$31 | v52.2,40.92 52.2,33.76 57.07,28.88 60.2,28.88 61.04,29.72 v64.92,29.72 | v69.42,40.39 69.42,42.6 71.25,44.42 v71.32,44.42
  Bottom 0.305: v65.84,55.02 65.53,55.02 v63.78,56.77 | v52.2,40.92 v52.2,47.62 | v64.92,29.72 64.92,35.05 65.3,35.43 65.3,38.63 67.06,40.39 v69.42,40.39 | v71.32,44.42 71.32,49.23 71.02,49.53 71.02,49.91 v70.26,50.67
ANLG0R
  Top 0.305: IC2.2 68.89,52.2 68.89,57.76 67.89,58.75 67.89,62.03 68.58,62.71 SV1.3
ANLG1  (via drill 0.3)
  Top 0.305: v68.28,57.45 66.67,57.45 64.62,59.51 60.88,59.51 60.35,58.98 60.35,58.14 61.95,56.54 61.95,56.01 RN1.3 | v59.13,71.17 58.14,72.16 41.91,72.16 40.77,71.02 40.77,62.94 42.37,61.34 42.37,60.73 MC1.P$30 | v63.09,65.68 v59.13,69.65
  Bottom 0.305: v68.28,57.45 69.27,57.45 73.99,52.73 IC2.4 | v59.13,69.65 v59.13,71.17 | v63.09,65.68 63.09,62.03 63.63,61.49 63.63,57.61 62.03,56.01 RN1.3
ANLG1R
  Top 0.305: IC2.3 71.48,52.2 71.48,57.76 73,59.28 73,62.03 73.69,62.71 SV1.7
ANLG2  (via drill 0.3)
  Top 0.305: v67.06,48.84 67.67,48.84 68.05,48.46 73.3,48.46 75.51,50.67 75.51,53.57 81.69,59.74 IC2.8 | v51.44,48.39 42.44,57.38 42.44,58.06 MC1.P$29 | v51.44,40.92 51.44,33.83 57.99,27.28 61.42,27.28 v63.25,29.11 | v64.39,35.89 64.39,36.12 64.77,36.5 64.77,38.79 v61.34,42.22 | v60.05,49.07 60.05,51.51 61.95,53.42 RN1.4
  Bottom 0.305: v67.06,48.84 62.48,53.42 62.03,53.42 RN1.4 | v51.44,40.92 v51.44,48.39 | v63.25,29.11 63.25,34.75 v64.39,35.89 | v61.34,42.22 61.34,44.27 60.05,45.57 v60.05,49.07
ANLG2R
  Top 0.305: IC2.9 79.02,59.82 79.02,62.56 78.87,62.71 SV1.11
ANLG3  (via drill 0.3)
  Top 0.305: v59.74,64.92 v59.74,68.12
  Bottom 0.305: 60.96,54.48 60.35,53.87 60.35,53.03 61.95,51.44 61.95,50.98 RN1.5 | 60.96,54.48 65.46,54.48 65.53,54.41 66.14,54.41 66.45,54.71 66.45,57.38 65.38,58.45 65.38,60.88 65.99,61.49 72.31,61.49 IC2.11 | v59.74,68.12 59.74,71.48 59.05,72.16 57.15,72.16 56.31,71.32 56.31,62.64 49.3,55.63 42.44,55.63 MC1.P$28 | v59.74,64.92 59.74,63.78 60.35,63.17 60.35,55.09 60.96,54.48
ANLG3R
  Bottom 0.305: IC2.10 76.58,59.82 77.04,59.82 78.87,61.65 82.75,61.65 83.82,62.71 SV1.15
AREF  (via drill 0.3)
  Top 0.152: v66.37,44.65 68.96,44.65 v70.03,45.72 | MC1.P$32 42.44,65.68 55.93,65.68 57.15,64.47 59.44,64.47 59.51,64.39 62.64,64.39 64.47,66.22 66.52,66.22 67.67,65.08 67.67,64.92 68.28,64.31 69.04,64.31 70.18,65.46 70.18,65.61 70.79,66.22 71.63,66.22 72.77,65.08 72.77,64.85 73.91,63.7 74.14,63.7 74.91,62.94 74.91,55.02 72.39,52.5 72.39,51.13 70.79,49.53 70.1,49.53 R3.1
  Bottom 0.152: v66.37,44.65 59.97,38.25 59.97,34.52 60.96,33.53 60.96,28.27 C10.1 | v70.03,45.72 70.03,49.45 R3.1
D7GATE  (via drill 0.3)
  Top 0.152: v84.81,23.47 85.11,23.47 85.57,23.93 87.86,23.93 | 87.86,23.93 91.06,23.93 93.95,21.03 J1.4 | 69.65,59.82 71.4,59.82 IC2.12 | 69.65,59.82 68.96,59.82 IC2.13 | 69.65,59.82 69.65,63.09 69.04,63.7 68.28,63.7 67.67,63.09 67.67,62.94 66.45,61.72 66.37,61.72 64.77,60.12 60.88,60.12 58.9,58.14 57.68,58.14 MC1.P$6 | v87.86,26.98 87.86,23.93 | v81.23,47.93 79.1,50.06 79.1,52.12 IC2.6
  Bottom 0.152: v84.81,23.47 84.43,23.47 82.22,25.68 81.15,25.68 SV3.11 | 77.53,53.68 78.26,54.41 78.72,54.41 79.02,54.1 79.02,52.2 IC2.6 | 77.53,53.68 76.58,52.73 76.58,52.2 IC2.5 | 77.53,53.68 71.48,59.74 IC2.12 | v87.86,26.98 87.86,35.59 82.68,40.77 82.37,40.77 81.23,41.91 v81.23,47.93
DATA+  (via drill 0.3)
  Top 0.152: 84.73,7.92 88.92,7.92 R10.1 | 84.73,7.92 v73.15,7.92 | v84.66,20.95 84.66,13.11 84.73,13.03 84.73,7.92 | v70.71,20.73 69.95,21.49 53.26,21.49 51.82,20.04 50.06,20.04 X1.3
  Bottom 0.152: v73.15,7.92 68.28,3.05 55.02,3.05 R301.1 | IC3.6 80.31,45.8 80.31,42.37 82.91,39.78 83.21,39.78 87.33,35.66 87.33,23.62 v84.66,20.95 83.9,20.19 71.25,20.19 v70.71,20.73
DATA+R
  Top 0.152: R10.2 94.03,7.92 94.03,4.72 92.81,3.5 JP10.1
DATA-  (via drill 0.3)
  Top 0.152: v67.74,30.18 v74.3,36.73 | X1.2 53.87,20.04 54.56,20.73 v58.9,20.73 v61.27,18.36
  Bottom 0.152: 82.37,1.37 88.16,1.37 90.22,3.43 JP10.2 | 82.37,1.37 46.33,1.37 45.11,2.59 45.11,2.97 R302.2 | v74.3,36.73 74.3,39.24 77.72,42.67 77.72,45.8 IC3.7 | v67.74,30.18 67.74,29.57 v58.9,20.73 | 82.37,1.37 82.37,11.43 81.92,11.89 81.92,13.95 82.37,14.4 82.37,15.62 79.63,18.36 v61.27,18.36
DIN2
  Bottom 0.152: JP7.2 20.57,6.02 20.88,6.02 23.24,8.38 71.86,8.38 75.97,12.5 J7.2
DIN4
  Bottom 0.152: JP7.1 23.09,5.94 43.89,5.94 46.02,3.81 46.02,2.13 46.25,1.91 67.89,1.91 80.92,14.94 J7.4
DIN5
  Top 0.152: JP7.3 17.98,5.94 18.36,5.94 20.12,4.19 58.45,4.19 69.19,14.94 70.94,14.94 J7.5
DMXRX
  Top 0.152: 78.41,34.98 78.03,34.59 78.03,32.54 DMXRX.1 | 78.41,34.98 75.21,38.18 IC3.1 | 78.41,34.98 JP3.1
DTCT0  (via drill 0.3)
  Top 0.152: v59.74,62.87 61.57,62.87 63.93,65.23 66.06,65.23 SV1.2 | v63.78,53.65 62.33,55.09 58.14,55.09 57.68,55.55 MC1.P$7
  Bottom 0.152: v59.74,62.87 59.74,57.68 57.68,55.63 MC1.P$7 | v63.78,53.65 63.78,52.81 65.99,50.6 66.06,50.6 67.59,49.07 67.59,44.04 70.41,41.22 70.41,39.85 75.97,34.29 75.97,28.27 SV3.8
DTCT1
  Top 0.152: SV1.6 71.17,65.23 70.41,65.23 69.19,64.01 63.17,64.01 61.49,62.33 58.52,62.33 57.68,63.17 MC1.P$4
  Bottom 0.152: SV3.10 78.56,28.27 78.56,32.92 79.48,33.83 79.48,37.03 79.32,37.19 79.32,50.44 80.01,51.13 80.01,53.65 75.59,58.06 75.59,60.81 76.5,61.72 76.66,61.72 77.27,62.33 77.27,63.09 76.05,64.31 72.16,64.31 71.25,65.23 SV1.6
DTCT2  (via drill 0.3)
  Top 0.152: v84.2,40.77 84.89,40.08 84.89,33.22 81.15,29.49 81.15,28.27 SV3.12 | v76.43,57.99 75.29,59.13 75.29,64.31 76.2,65.23 SV1.10
  Bottom 0.152: SV1.10 76.2,65.3 75.06,65.3 73,67.36 67.51,67.36 67.44,67.44 65.23,67.44 64.01,66.22 58.14,66.22 57.68,65.76 MC1.P$3 | v84.2,40.77 84.2,42.44 81.76,44.88 81.76,48.16 81.38,48.54 80.62,48.54 80.01,49.15 80.01,50.67 80.31,50.98 80.31,54.1 v76.43,57.99
DTCT3  (via drill 0.3)
  Top 0.152: v67.06,68.28 61.27,68.28 58.75,70.79 57.68,70.79 MC1.P$1 | SV3.14 83.67,28.27 83.67,30.63 91.97,38.94 91.97,56.54 84.2,64.31 82.3,64.31 81.38,65.23 SV1.14
  Bottom 0.152: v67.06,68.28 67.67,67.67 75.21,67.67 77.27,65.61 77.27,65.46 78.41,64.31 79.25,64.31 80.16,65.23 81.31,65.23 SV1.14
GND  (via drill 0.3)
  Top 0.305: RN1.1 62.03,61.11 64.47,61.11 66.06,62.71 SV1.1 | 79.25,63.78 80.24,62.79 81.31,62.79 SV1.13 81.46,62.64 81.46,62.03 84.51,58.98 84.51,57.45 C8.2 84.51,57.3 86.94,57.3 C9.2 | 79.25,63.78 77.27,63.78 76.28,62.79 SV1.9 | 79.25,63.78 79.86,64.39 79.86,65.23 80.92,66.29 86.56,66.29 90.22,69.95 92.43,69.95 JP6.2 | 65,39.47 61.65,42.82 57.68,42.82 MC1.P$21 | 65,39.47 66.22,38.25 OK1.3 | 65,39.47 70.64,45.11 70.64,46.02 70.33,46.33 69.72,46.33 69.27,45.87 68.89,45.87 OK1.5 | J6.2 93.88,32.99 93.88,32.54 92.81,31.47 92.81,28.19 93.95,27.05 J1.1 | IC2.7 81.69,52.12 82.75,51.05 82.75,45.87 IC3.5 82.6,45.87 80.01,43.28 71.55,43.28 C6.2 | v47.02,7.85 47.02,9.37 49.99,12.34 49.99,14.86 X1.G 49.91,15.01 49.91,16.31 46.25,19.96 X1.1 46.1,19.89 45.34,19.13 39.62,19.13 32.84,12.34 32,12.34 SV2.1 | 7.92,67.06 7.92,68.96 J10.1 | 7.92,67.06 7.92,66.14 3.2,61.42 3.05,61.42 J5.6 | JP2.2 27.81,53.87 31.47,57.53 35.81,57.53 36.73,58.45 C7.2 | J0.1 35.43,66.98 32.46,64.01 J0.2 30.56,63.93 28.42,63.93 27.05,62.56 19.81,62.56 15.32,67.06 7.92,67.06 | MC1.P$12 42.37,37.8 41.6,37.03 38.1,37.03 R2.1 37.95,37.11 36.2,38.86 | 36.2,38.86 34.75,40.31 31.7,40.31 IC1.7 | C1.2 36.73,23.93 35.59,23.93 34.67,23.01 33.83,23.01 31.85,24.99 31.85,26.14 31.24,26.75 29.26,26.75 28.04,27.96 C2.2 | T1.E 25.53,37.41 25.53,35.28 26.75,34.06 C4.2 | 36.2,38.86 33.3,35.97 31.77,35.97 29.03,38.71 C5.2 | JP5.1 3.05,47.4 3.2,47.4 7.16,43.43 7.16,38.18 6.02,37.03 J2.1 | v8.53,45.57 8.53,44.5 9.91,43.13 9.91,32.08 10.36,31.62 U1.1 10.52,31.47 10.52,31.32 18.59,23.24 18.59,23.01 V1.GND 18.67,22.86 22.48,19.05 v22.48,18.36
  Top 0.305: v64.01,24.31 62.41,24.31 61.04,25.68 C10.2
  Bottom 0.305: SV1.9 76.2,62.79 75.21,63.78 73.3,63.78 72.31,62.79 71.25,62.79 SV1.5 71.09,62.79 70.1,63.78 68.2,63.78 67.21,62.79 66.14,62.79 SV1.1 | OK1.5 68.89,45.8 71.48,43.2 C6.2 | OK1.3 66.29,38.18 66.29,35.74 72.01,30.02 72.01,28.19 73.46,26.75 73.46,25.76 SV3.5 73.3,25.76 72.47,25.76 71.02,24.31 v64.01,24.31 | IC3.5 82.83,45.8 82.98,45.8 85.5,43.28 C11.2 85.57,43.2 88.62,40.16 90.22,40.16 91.36,39.01 91.36,35.97 93.88,33.45 93.88,33.07 J6.2 | IC2.7 81.69,52.2 81.69,54.48 84.43,57.23 C8.2 | 22.48,13.41 25.76,13.41 26.82,12.34 SV2.5 26.98,12.34 28.04,13.41 29.79,13.41 30.86,12.34 31.93,12.34 SV2.1 | 22.48,13.41 16.31,13.41 15.24,12.34 14.17,12.34 SV2.15 | v47.02,7.85 47.02,3.05 R302.1 | C10.2 60.96,25.68 58.29,25.68 54.18,21.57 47.78,21.57 46.25,20.04 X1.1 | C7.2 36.8,58.52 36.8,59.21 38.02,60.43 38.02,64.47 35.51,66.98 J0.1 | C2.2 28.04,28.04 28.04,30.94 C3.2 27.96,31.09 26.82,32.23 | 26.82,32.23 26.82,33.98 C4.2 | 27.96,38.71 26.75,38.71 25.53,37.49 T1.E | 27.96,38.71 28.96,38.71 C5.2 | v8.53,45.57 6.71,47.4 3.05,47.4 JP5.1 | 26.82,32.23 26.75,32.16 25.53,32.16 22.1,28.73 21.95,28.73 20.5,27.28 20.5,24.84 18.67,23.01 V1.GND | 27.96,38.71 27.96,41.6 29.41,43.05 29.41,51.44 27.81,53.03 27.81,53.8 JP2.2 | v22.48,18.36 22.48,13.41
  pour Top: -1,-1 101,-1 101,76 -1,76
  pour Bottom: -2,-2 102,-2 102,77 -2,77
GPIO0  (via drill 0.3)
  Top 0.152: v59.44,46.18 v64.92,40.69 | v59.44,49.68 59.44,51.28 57.68,53.03 MC1.P$8 57.61,53.11 v51.74,58.98
  Bottom 0.152: v64.92,40.69 64.92,35.66 64.39,35.13 64.39,29.49 64.69,29.18 65.15,29.18 66.67,30.71 67.97,30.71 68.35,30.33 68.35,28.27 SV3.2 | v59.44,49.68 v59.44,46.18 | v51.74,58.98 43.74,66.98 41.99,66.98 37.19,71.78 24.08,71.78 22.48,70.18 22.48,67.28 21.41,66.22 20.95,66.22 15.09,60.35 15.09,60.05 11.05,56.01 10.21,56.01 8.46,54.25 2.52,54.25 1.22,52.96 1.22,46.25 5.94,41.53 5.94,41.07 J2.3
GPIO1  (via drill 0.3)
  Top 0.152: v46.56,13.03 34.14,13.03 32.38,11.28 23.85,11.28 22.78,12.34 22.78,12.72 18.9,16.61 18.59,16.61 4.95,30.25 4.95,41.99 5.94,42.98 J2.4 5.56,42.67 1.22,47.02 1.22,52.96 1.37,53.11 v1.37,60.81 | v51.66,60.73 57.61,60.73 MC1.P$5
  Bottom 0.152: v46.56,13.03 51.97,13.03 65.68,26.75 68.28,26.75 69.72,28.19 70.87,28.19 SV3.4 | v51.66,60.73 42.82,69.57 39.85,69.57 37.34,72.08 21.87,72.08 19.51,69.72 19.51,69.34 18.44,68.28 15.85,68.28 11.66,64.08 5.71,64.08 3.73,62.1 2.67,62.1 v1.37,60.81
LED0  (via drill 0.3)
  Top 0.152: v74.52,47.85 76.12,49.45 78.03,49.45 R4.2 | v68.05,49.38 66.14,49.38 65.3,48.54 58.75,48.54 57.99,49.3 57.07,49.3 43.59,62.79 43.59,63.7 42.75,64.54 41.83,64.54 41.15,65.23 41.15,69.57 42.37,70.79 MC1.P$34 | v58.75,22.4 72.01,22.4 v73.76,24.16
  Bottom 0.152: v74.52,47.85 73.3,47.85 71.4,49.76 71.4,50.29 70.48,51.21 69.88,51.21 v68.05,49.38 | v58.75,22.4 57.91,21.57 57.91,21.03 52.96,16.08 48.08,16.08 43.28,11.28 26.44,11.28 25.45,12.27 24.38,12.27 SV2.7 | v73.76,24.16 74.98,25.38 74.98,26.14 76.05,27.2 76.35,27.2 77.04,27.89 77.04,36.96 76.81,37.19 76.81,41.3 78.64,43.13 78.64,48.92 78.11,49.45 R4.2
LED0A  (via drill 0.3)
  Top 0.152: v79.02,57.99 75.13,54.1 75.13,51.36 73.3,49.53 73,49.53 R4.1 | 90.6,66.98 90.6,67.74 91.82,68.96 93.65,68.96 94.26,69.57 94.26,70.71 92.51,72.47 JP6.3 | 90.6,66.98 98.91,58.67 98.91,56.01 98.37,55.47 97,55.47 95.4,53.87 95.4,32.99 93.95,31.55 93.95,31.01 J6.3 | 90.6,66.98 v90.6,66.83
  Bottom 0.152: v79.02,57.99 81.76,57.99 v90.6,66.83
LED1
  Top 0.152: IC3.2 77.8,38.18 80.24,38.18 IC3.3 80.31,38.25 83.13,41.07 83.13,42.22 86.03,45.11 86.03,49.45 R5.2
  Bottom 0.152: MC1.P$2 57.68,68.28 58.83,68.28 59.51,67.59 64.92,67.59 66.14,68.81 71.7,68.81 72.54,67.97 90.83,67.97 91.36,68.5 93.65,68.5 94.26,67.89 94.26,65.84 86.11,57.68 86.11,49.53 R5.2
LED1A
  Bottom 0.152: 82.03,49.42 89.38,42.06 90.75,42.06 93.88,38.94 93.88,35.05 J6.1 | 82.03,49.42 81.99,49.45 81,49.45 R5.1 | 82.03,49.42 85.42,52.81 85.42,57.45 92.43,64.47 92.43,67.44 JP6.1
MIN  (via drill 0.3)
  Top 0.152: v36.42,55.55 31.7,55.55 IC1.1 | v53.95,17.83 68.58,17.83 v71.48,20.73 | v75.44,32.77 76.81,31.39 v79.1,31.39
  Bottom 0.152: v36.42,55.55 37.64,54.33 58.06,54.33 58.83,53.57 58.83,52.12 63.7,47.24 63.7,45.87 OK1.7 63.7,47.32 65.15,47.32 65.91,48.08 66.6,48.08 67.28,47.4 67.28,43.28 70.1,40.46 70.1,38.1 v75.44,32.77 | v53.95,17.83 47.7,17.83 46.71,16.84 29.79,16.84 27.51,19.13 27.51,19.43 RN2.2 | v71.48,20.73 77.11,20.73 77.5,21.11 77.5,26.14 78.56,27.2 78.94,27.2 80.09,28.35 80.09,31.39 | 80.09,31.39 80.09,31.55 83.52,34.98 JP3.3 | 80.09,31.39 v79.1,31.39
MIRTN
  Bottom 0.305: OK1.2 63.7,38.18 63.7,37.49 61.27,35.05 D3.A 61.27,34.9 62.03,34.14 62.03,24.77 58.29,21.03 58.29,20.8 51.13,13.64 46.25,13.64 43.51,10.9 21.57,10.9 20.19,12.27 19.28,12.27 SV2.11
MISND
  Top 0.152: RN4.15 97.38,53.8 97.38,53.19 98.91,51.66 98.91,15.85 84.43,1.37 19.96,1.37 15.7,5.64 15.7,12.72 16.31,13.34 20.73,13.34 21.72,12.34 SV2.9
MISNDA  (via drill 0.3)
  Top 0.305: OK1.1 61.27,38.18 61.27,37.95 64.16,35.05 68.81,35.05 D3.C 68.96,35.05 74.07,40.16 79.25,40.16 85.5,46.41 v85.5,46.71
  Bottom 0.305: v85.5,46.71 87.02,48.23 87.02,50.67 89.69,53.34 89.69,53.8 RN4.2
MISO  (via drill 0.3)
  Top 0.152: v10.29,56.54 12.88,56.54 23.93,45.49 23.93,42.14 25.15,40.92 26.52,40.92 28.04,39.4 28.04,38.41 31.55,34.9 40.23,34.9 42.37,32.77 MC1.P$19
  Bottom 0.152: v10.29,56.54 8.76,55.02 3.05,55.02 J5.1
MNTR
  Bottom 0.152: 64.35,43.93 66.22,45.8 OK1.6 | 64.35,43.93 59.66,39.24 59.66,30.02 55.09,25.45 55.09,24.54 RN3.5 | 64.35,43.93 62.79,45.49 62.79,47.09 58.14,51.74 57.23,51.74 55.93,53.03 42.44,53.03 MC1.P$27
MNTRA
  Top 0.152: OK1.4 68.89,38.25 68.89,42.75 73.99,47.85 73.99,48.08 76.2,50.29 77.04,50.29 77.95,51.21 77.95,54.1 79.86,56.01 89.31,56.01 RN4.1
MO2RTNR  (via drill 0.3)
  Top 0.152: v82.6,41.3 81,41.3 79.48,39.78 74.83,39.78 70.03,34.98 70.03,34.52 69.27,33.76 60.73,33.76 59.28,35.2 59.28,37.87 58.06,39.09 54.79,39.09 50.75,43.13 v50.37,43.13
  Bottom 0.152: v82.6,41.3 85.27,38.63 89.69,38.63 RN4.8 | v50.37,43.13 50.37,44.27 42.9,51.74 40.46,51.74 39.32,50.6 IC1.12
MORTN
  Bottom 0.152: RN4.13 97.31,48.16 95.02,45.87 95.02,30.56 83.36,18.9 58.29,18.9 48.08,8.69 16.31,8.69 15.16,9.83 15.16,10.13 14.02,11.28 12.65,11.28 11.66,12.27 SV2.17
MORTNR
  Top 0.152: IC1.10 39.32,45.49 40.69,45.49 41.91,46.71 59.51,46.71 60.88,48.08 73.53,48.08 76.05,50.6 76.89,50.6 77.65,51.36 77.65,54.25 79.7,56.31 87.63,56.31 88.62,57.3 90.75,57.3 91.29,56.77 91.29,50.37 89.76,48.84 RN4.4
MOSI  (via drill 0.3)
  Top 0.152: v35.81,29.18 25.98,39.01 15.01,39.01 12.5,41.53 12.5,51.74 5.49,58.75 3.05,58.75 J5.4
  Bottom 0.152: v35.81,29.18 41.68,29.18 41.91,28.96 56.39,28.96 57.61,30.18 MC1.P$17
MOSND
  Top 0.152: RN4.14 97.31,51.28 97.31,50.75 95.71,49.15 95.71,13.11 86.79,4.19 58.9,4.19 58.6,3.89 17.91,3.89 16.92,4.88 16.92,8.53 17.75,9.37 17.75,11.28 16.76,12.27 SV2.13
MTRTNR  (via drill 0.3)
  Top 0.152: v50.83,33.83 57.99,26.67 65.99,26.67 v67.13,25.53 | v72.54,26.75 73.38,26.75 74.98,28.35 74.98,28.73 76.81,30.56 81.31,30.56 82.53,31.77 82.53,36.5 81.92,37.11 81.92,39.24 85.04,42.37 88.39,42.37 89.69,43.66 RN4.6
  Bottom 0.152: v50.83,33.83 45.64,39.01 41.99,39.01 40.69,40.31 39.32,40.31 IC1.8 | v67.13,25.53 67.97,24.69 68.81,24.69 69.88,25.76 69.88,26.14 70.48,26.75 v72.54,26.75
NMO2RTN
  Top 0.152: 35.17,45.3 35.74,45.87 35.74,50.22 38.56,53.03 39.24,53.03 IC1.13 | 35.17,45.3 32.84,42.98 31.7,42.98 IC1.6 | 35.17,45.3 36.42,44.04 40.16,44.04 40.92,43.28 40.92,42.6 41.83,41.68 42.75,41.68 43.89,40.54 43.89,23.93 39.47,19.51 35.13,19.51 RN2.5
NMORTN
  Bottom 0.152: IC1.11 39.24,48.01 IC1.4 31.62,47.93 30.1,46.41 30.1,38.56 29.87,38.33 29.87,30.25 29.95,30.18 29.95,25.3 31.24,24 31.24,21.41 32.54,20.12 RN2.4
NMTRTN  (via drill 0.3)
  Top 0.152: v31.77,21.64 30.02,19.89 30.02,19.51 RN2.3 | v35.59,41.83 38.18,41.83 39.24,42.9 IC1.9 | v33.53,45.41 33.53,50.67 31.7,52.5 31.7,53.03 IC1.2
  Bottom 0.152: v31.77,21.64 31.77,23.93 30.25,25.45 30.25,30.33 30.18,30.4 30.18,36.42 v35.59,41.83 35.51,41.83 33.53,43.81 v33.53,45.41
RLY
  Bottom 0.152: R1.2 32.99,34.06 37.72,38.79 37.72,40.77 38.56,41.6 49.61,41.6 50.9,42.9 50.9,48.62 52.73,50.44 57.61,50.44 MC1.P$9
RLYDRV
  Top 0.152: T1.B 25.53,42.52 26.44,42.52 29.34,39.62 30.33,39.62 32.92,37.03 R2.2
  Bottom 0.152: R1.1 38.02,33.98 36.35,33.98 32.16,29.79 31.24,29.79 30.48,30.56 30.48,34.52 32.92,36.96 R2.2
RLYOUT  (via drill 0.3)
  Top 0.152: v25.68,61.95 v19.89,56.16 | v34.98,71.25 36.96,71.25 39.62,73.91 73.61,73.91 78.03,69.49 78.03,68.5 77.5,67.97 74.07,67.97 73.08,68.96 J4.1
  Bottom 0.152: v19.89,56.16 19.89,55.7 10.97,46.79 10.97,42.6 K1.10 | v34.98,71.25 v25.68,61.95
RLYSNK
  Top 0.152: K1.9 13.49,42.52 16,40.01 25.45,40.01 T1.C 25.53,39.93 34.44,31.01 39.24,31.01 D2.A
RST  (via drill 0.3)
  Top 0.152: v12.12,57.91 26.44,43.59 29.03,43.59 31.32,41.3 41.45,41.3 42.37,40.39 MC1.P$13 42.44,40.31 43.59,39.17 43.59,24.08 41.38,21.87 35.51,21.87 34.14,20.5 34.14,19.13 29.41,14.4 29.41,12.34 SV2.3
  Bottom 0.152: v12.12,57.91 6.48,57.91 4.34,60.05 3.05,60.05 J5.5 | MC1.P$22 57.61,40.39 42.44,40.39 MC1.P$13
RX
  Top 0.152: JP3.2 81,34.98 81,32.54 RX.1 80.92,32.46 79.32,30.86 74.6,30.86 72.47,28.73 72.47,28.35 70.94,26.82 | 70.94,26.82 70.94,25.76 SV3.3 | 70.94,26.82 69.88,27.89 69.88,28.19 68.81,29.26 67.89,29.26 66.6,30.56 63.48,30.56 58.98,35.05 58.98,35.66 57.68,36.96 57.68,37.8 MC1.P$14
SCK
  Top 0.152: J5.3 3.05,57.53 6.25,57.53 12.19,51.59 12.19,41.38 17.22,36.35 17.22,30.79 22.25,25.76 24.08,25.76 27.66,22.17 41.22,22.17 42.37,23.32 42.37,30.18 MC1.P$18
SCL  (via drill 0.3)
  Top 0.152: SV3.9 78.49,25.68 77.42,25.68 75.44,23.7 74.07,23.7 72.24,21.87 52.65,21.87 50.06,24.46 RN3.3 | v86.79,27.51 88.09,27.51 92.58,23.01 93.95,23.01 J1.3 | v44.65,49.23 49.84,49.23 51.97,47.09 56.77,47.09 57.61,47.93 MC1.P$10
  Bottom 0.152: RN3.3 50.06,24.54 50.6,24.54 54.71,28.65 57.84,28.65 58.83,29.64 58.83,46.79 57.68,47.93 MC1.P$10 | v86.79,27.51 84.28,27.51 83.52,26.75 79.55,26.75 78.56,25.76 SV3.9 | v44.65,49.23 41.91,49.23 41.83,49.15 36.2,49.15 35.74,49.61 35.74,50.98 32.69,54.03 31.32,54.03 30.1,55.24 30.1,55.78 27.81,58.06 27.81,58.9 JP2.4
SDA  (via drill 0.3)
  Top 0.152: 47.47,26.06 47.47,41 47.51,41.03 | 47.47,26.06 47.47,24.54 RN3.2 | 47.51,41.03 51.89,45.41 57.61,45.41 MC1.P$11 | v63.32,23.62 57.91,23.62 55.47,26.06 47.47,26.06 | v76.89,21.26 77.11,21.49 84.89,21.49 88.47,17.91 94.41,17.91 95.1,18.59 95.1,23.39 94.03,24.46 94.03,24.99 J1.2 | 47.51,41.03 44.42,44.12 41.99,44.12 41.76,44.35 38.48,44.35 37.72,45.11 37.72,45.8 38.33,46.41 39.7,46.41 40.92,47.62 40.92,55.93 37.41,59.44 34.06,59.44 32.08,61.42 27.81,61.42 JP2.5
  Bottom 0.152: 74.26,23.89 73.99,23.62 v63.32,23.62 | 74.26,23.89 74.3,23.93 74.3,24 75.97,25.68 SV3.7 | 74.26,23.89 v76.89,21.26
THS  (via drill 0.3)
  Top 0.152: v73,24.16 71.78,22.94 54.71,22.94 53.19,24.46 52.58,24.46 RN3.4 | v11.51,66.45 19.36,58.6 19.36,55.93 22.14,53.15 | 22.14,53.15 22.63,52.65 29.34,52.65 30.86,54.18 v37.03,54.18 | v12.5,40.31 12.5,36.5 12.95,36.04 12.95,31.55 U1.2 | 22.14,53.15 v19.89,50.9
  Bottom 0.152: v73,24.16 73.53,24.69 73.84,24.69 74.52,25.38 74.52,27.2 73.53,28.19 SV3.6 | v11.51,66.45 10.06,67.89 10.06,68.96 J10.2 | v37.03,54.18 37.03,53.87 37.72,53.19 37.72,50.14 38.25,49.61 41.53,49.61 42.37,50.44 MC1.P$26 | v12.5,40.31 12.5,43.51 v19.89,50.9 | RN3.4 52.5,24.46 51.89,24.46 50.37,22.94 47.09,22.94 45.87,24.16 45.87,25.53 45.34,26.06 43.59,26.06 35.43,17.91 32.16,17.91 30.94,19.13 30.94,23.85 29.64,25.15 29.64,30.02 28.96,30.71 28.96,33.15 27.2,34.9 26.36,34.9 25.15,33.68 25.15,33.6 23.47,31.93 21.87,31.93 20.12,30.18 14.33,30.18 13.03,31.47 U1.2
TX  (via drill 0.3)
  Top 0.152: IC1.5 31.62,45.49 31.62,46.1 30.1,47.62 30.1,49 31.62,50.52 IC1.3 | IC3.4 82.83,38.18 82.83,37.95 84.58,36.2 84.58,33.38 80.47,29.26 78.11,29.26 77.04,28.19 77.04,27.89 75.89,26.75 75.59,26.75 74.52,25.68 74.52,25.38 73.84,24.69 69.42,24.69 68.43,25.68 SV3.1 68.35,25.76 67.36,26.75 67.36,28.04 65.15,30.25 63.32,30.25 58.37,35.2 57.68,35.2 MC1.P$15 | v49.38,42.14 49.38,41.3 v50.83,39.85
  Bottom 0.152: v49.38,42.14 44.88,46.63 33.98,46.63 32.84,45.49 31.7,45.49 IC1.5 | v50.83,39.85 53.03,39.85 57.61,35.28 MC1.P$15
V+  (via drill 0.3)
  Top 1.016: 29.41,29.34 30.33,29.34 31.62,28.04 D1.C 32,27.58 34.21,25.38 34.21,24 C1.1 | 29.41,29.34 27.51,29.34 26.21,28.04 23.01,28.04 C2.1 | v20.88,63.4 20.88,64.85 18.52,67.21 JP1.1 18.06,67.59 16.99,68.66 16.99,70.33 19.13,72.47 27.51,72.47 30.94,69.04 37.11,69.04 38.41,67.74 38.41,66.29 35.51,63.4 35.51,61.04 J0.3 | 29.41,29.34 29.41,33.3 v26.59,36.12
  Bottom 1.016: V1.IN 18.67,20.5 18.97,20.5 21.41,22.94 21.41,26.98 22.4,27.96 22.94,27.96 C2.1 | 17.64,59.85 20.88,63.09 v20.88,63.4 | 17.64,59.85 10.29,52.5 3.05,52.5 JP5.3 | v26.59,36.12 24.31,36.12 22.4,38.02 22.4,44.27 19.36,47.32 19.36,49 20.88,50.52 20.88,56.62 17.64,59.85
VCC  (via drill 0.3)
  Top 0.508: v68.5,43.89 64.08,43.89 62.18,45.8 61.27,45.8 OK1.8 | SV3.13 83.59,25.76 83.59,26.59 82.45,27.74 82.45,30.1 85.42,33.07 85.42,40.54 C11.1 85.57,40.77 89.31,40.77 RN4.7 89.76,41.38 91.44,43.05 91.44,44.12 89.76,45.8 89.76,46.18 RN4.5 89.53,46.41 87.94,48.01 87.94,49.23 89.61,50.9 89.61,51.05 RN4.3 89.69,51.36 89.69,51.66 86.87,54.48 C9.1 86.94,54.71 84.51,54.71 C8.1 84.28,54.63 79.25,54.63 v78.49,53.87 | J1.5 93.95,19.05 90.3,19.05 v85.95,23.39 85.72,23.32 84.43,22.02 75.44,22.02 69.34,15.93 51.36,15.93 | J5.2 3.05,56.24 3.35,55.93 3.43,55.93 4.95,54.41 4.95,51.97 3.05,50.06 JP5.2 | RN2.1 20.57,23.85 20.57,26.44 15.54,31.47 U1.3 15.39,31.7 13.49,33.6 13.49,37.41 K1.2 | v17.3,65.99 14.33,68.96 12.04,68.96 J10.3 | v28.5,43.05 28.96,42.6 28.96,41.3 C5.1 | 29.11,45.8 29.49,46.18 29.49,49.61 27.81,51.28 JP2.1 | 29.11,45.8 v28.5,45.19 | 34.29,45.87 34.29,45.11 33.53,44.35 30.56,44.35 29.11,45.8 | 34.29,45.87 34.29,50.29 39.24,55.24 39.24,55.55 IC1.14 | v24.84,63.17 21.03,66.98 21.03,67.21 JP1.3 | 51.36,15.93 51.36,16.76 47.85,20.27 47.85,21.57 44.96,24.46 RN3.1 44.81,24.69 44.81,40.31 42.44,42.67 42.44,42.82 MC1.P$23 | 51.36,15.93 v51.36,4.72 | v41.83,23.55 40.39,23.55 32.99,30.94 31.7,30.94 D2.C | v34.98,45.87 34.29,45.87
  Bottom 0.508: 71.55,41.76 71.55,40.77 C6.1 | 71.55,41.76 75.13,45.34 75.13,45.8 IC3.8 75.29,46.02 75.29,48.69 | v68.5,43.89 69.27,43.89 71.32,41.83 71.55,41.76 | 75.29,48.69 72.92,51.05 72.92,52.96 71.93,53.95 70.71,53.95 66.45,58.22 66.45,59.74 IC2.14 | v85.95,23.39 83.67,25.68 SV3.13 | 75.29,48.69 77.95,51.36 77.95,53.34 v78.49,53.87 | JP5.2 3.05,49.99 5.18,49.99 9.3,45.87 9.3,45.26 8.61,44.58 8.61,41.83 6.02,39.24 6.02,39.01 J2.2 6.1,38.79 6.1,38.63 7.92,36.8 7.92,25.98 15.62,18.29 15.7,18.06 | 15.7,18.06 9.98,12.34 9.14,12.34 SV2.19 | 15.7,18.06 21.11,18.06 22.48,19.43 24.92,19.43 RN2.1 25.15,19.58 25.3,19.58 26.98,21.26 27.89,21.26 28.88,20.27 28.88,18.44 29.95,17.37 35.66,17.37 v41.83,23.55 43.97,23.55 44.88,24.46 RN3.1 | v17.3,65.99 18.9,65.99 20.12,67.21 20.95,67.21 JP1.3 | C7.1 34.29,58.45 35.28,58.45 38.1,55.63 39.24,55.63 IC1.14 | v28.5,45.19 v28.5,43.05 | v24.84,63.17 24.84,54.25 27.74,51.36 JP2.1 | v51.36,4.72 53.03,3.05 R301.2 | v34.98,45.87 36.96,45.87 37.57,45.26 37.57,45.03 38.56,44.04 41.22,44.04 42.37,42.9 MC1.P$23
VCC/2  (via drill 0.3)
  Top 1.016: SV1.12 78.79,65.3 77.42,66.67 75.67,66.67 74.3,65.3 73.76,65.3 SV1.8 73.38,65.61 72.01,66.98 70.33,66.98 68.66,65.3 SV1.4 | v64.54,58.37 64.77,58.14 64.77,54.79 64.92,54.63 64.92,49.53 R3.2 | 93.12,56.46 97.31,56.46 RN4.16 | 93.12,56.46 84.35,65.23 83.9,65.23 SV1.16 | v8.99,53.72 8.99,47.4 7.54,45.95 7.54,44.27 8.84,42.98 8.84,27.43 18.9,17.37 28.73,17.37 v30.02,16.08 | v52.65,16.84 68.96,16.84 75.06,22.94 82.91,22.94 85.8,25.83 85.8,31.7 92.89,38.79 92.89,56.01 93.12,56.46
  Bottom 1.016: v64.54,58.37 64.54,65.68 65.53,66.67 67.21,66.67 68.58,65.3 SV1.4 | v8.99,53.72 9.83,53.72 15.85,59.74 15.85,60.05 20.42,64.62 20.88,64.62 23.47,67.21 JP1.5 | v30.02,16.08 47.02,16.08 47.78,16.84 v52.65,16.84 | SV1.12 78.87,65.3 79.17,65.3 80.54,66.67 82.45,66.67 83.82,65.3 SV1.16
VIN  (via drill 0.3)
  Top 1.016: v32.61,65.68 27.05,71.25 20.42,71.25 18.97,69.8 18.52,69.8 JP1.2 | v36.5,49.91 36.5,45.03 v36.58,44.96
  Bottom 1.016: v32.61,65.68 32.61,57.23 36.5,53.34 v36.5,49.91 | v36.58,44.96 36.58,38.71 33.22,35.36 32.38,35.36 31.62,34.59 31.62,33.45 32.46,32.61 33.91,32.61 36.65,35.36 42.29,35.36 42.37,35.28 MC1.P$20
VOUT  (via drill 0.3)
  Top 1.016: JP1.4 21.03,69.8 23.47,69.8 JP1.6 | v19.74,41.15 19.74,46.94 v20.57,47.78
  Bottom 1.016: v19.74,41.15 14.02,35.43 12.04,35.43 8.84,32.23 8.84,27.43 17.3,18.97 20.73,18.97 25.68,23.93 27.96,23.93 F1.2 | v20.57,47.78 20.57,48.54 22.1,50.06 22.1,63.7 24.99,66.6 24.99,68.28 23.55,69.72 JP1.6
VOUTRAW  (via drill 0.3)
  Top 1.016: B.1 21.49,33.98 19.2,33.98 19.05,33.83 JP4.2 | K1.5 21.11,37.41 21.11,34.44 B.1 | 22.94,32.46 22.94,31.01 C3.1 23.32,30.63 v24.31,29.64 | 22.94,32.46 21.79,33.6 B.1 | C4.1 24.16,33.98 23.09,32.92 22.94,32.46 | v31.39,70.26 37.03,70.26 39.93,73.15 70.94,73.15 74.45,69.65 74.45,69.57 74.98,69.04 J4.2 | v23.16,45.19 23.16,44.65 21.11,42.6 K1.6 | v31.01,25.76 29.11,25.76 v28.88,25.98
  Bottom 1.016: K1.6 21.11,42.52 21.11,37.49 K1.5 | V1.OUT 18.67,25.6 18.67,26.67 22.94,30.94 C3.1 | v31.39,70.26 30.56,70.26 23.32,63.02 23.32,45.34 v23.16,45.19 | v31.01,25.76 31.77,25.76 33.98,27.96 39.24,27.96 D1.A | v28.88,25.98 28.19,26.67 27.28,26.67 v24.31,29.64
VOUTRAW2  (via drill 0.3)
  Top 1.016: JP4.1 19.05,31.17 19.2,31.01 21.49,31.01 A.1 21.57,30.56 21.57,27.51 22.4,26.67 22.48,26.67 v22.63,26.52 | v12.19,33.91 10.97,35.13 10.97,37.41 K1.1 | v11.35,64.85 9.3,62.79 9.3,56.01 v12.42,52.88
  Bottom 1.016: v12.19,33.91 16.08,33.91 18.75,31.24 18.97,31.24 JP4.1 | v22.63,26.52 22.94,26.21 22.94,24 F1.1 | v11.35,64.85 19.66,73.15 72.92,73.15 76.43,69.65 76.43,69.57 76.96,69.04 J4.3 | v12.42,52.88 12.42,49.3 10.21,47.09 10.21,44.42 9.53,43.74 9.53,38.86 10.9,37.49 K1.1

### Text on the board
tNames: DC12V | USB | 0 | Vin | Vout | Vout | GeekPort II | THS* | LED1 (D11) / activates / DMX OUT | 1 | G | T* | V | V+ | Vcc | Vcc/2 | LED | G | SD | A | R | O | SC | 0 | C | Dual Regulator | V | NC | 1 | 0 | 4066 | 1 | 3 | 2 | 221 | I | SPI | OUT | G | Single Regulator | IN | 2 | 5V | 3 | OUT | PWR | Arduino Only | 102 | 102 | 102 | 103 | OUT | SparkFun / Real Time Clock / Module (12708) | Direct 5V | THRU | THRU | G1 | IN | 2630 | LED00 | RX/TX | 1485 | OR | 3468 | G0 | OUT2 | G5V-1 | 7406 | Vcc | OUT2 | GND | 473 | DMXRX | MIDIIN | 1 | 102 | GPIO (5V) | LED | Close Here | RX | 0 | G0 | G1 | TH | 00 | 01 | 02 | 03 | THS* | Arduino Micro | 2 | TestPort II | GND | 1 | MC1 | SDA | 472 | TX | RX | G | SD | SC | D7 | V | MKR | SCL | M | I | T | O | 2 | SD | SC | T* | MN | Note: Close RX and G / when RX is not used. | D7 | Vcc | 472 | 1 | 3 | 1 | 2 | (IN/OUT) | (Vcc) | OUT5 | GND | OUT4 | IN5 | IN4 | LED0 | GND | RST | GND | 1 | 4-M2.3 | BackPort II | 2 | 101 | Designed for / Takachi / PF13-4-9 | (Connected to J7) | (Connected to JP7) | MIDI | 5 | 2 | 4 | DMX | MIDI | Install Neutrik NC3MBH | LED1 activates DMXOUT | Pineapple IId 2.6.5-B
bNames: C1: 22u / C2: 470n / C3: 1u / C4: 100n / C5-8: 10n / C9-10: 100n | Do not install R301 or R302